# Altium schematic sheet FPGA.SchDoc: =DocumentName
size A3; DocumentNumber: 1; Revision: 0; SheetNumber: 16; SheetTotal: 20; Last modified by: Krzysztof Belewicz
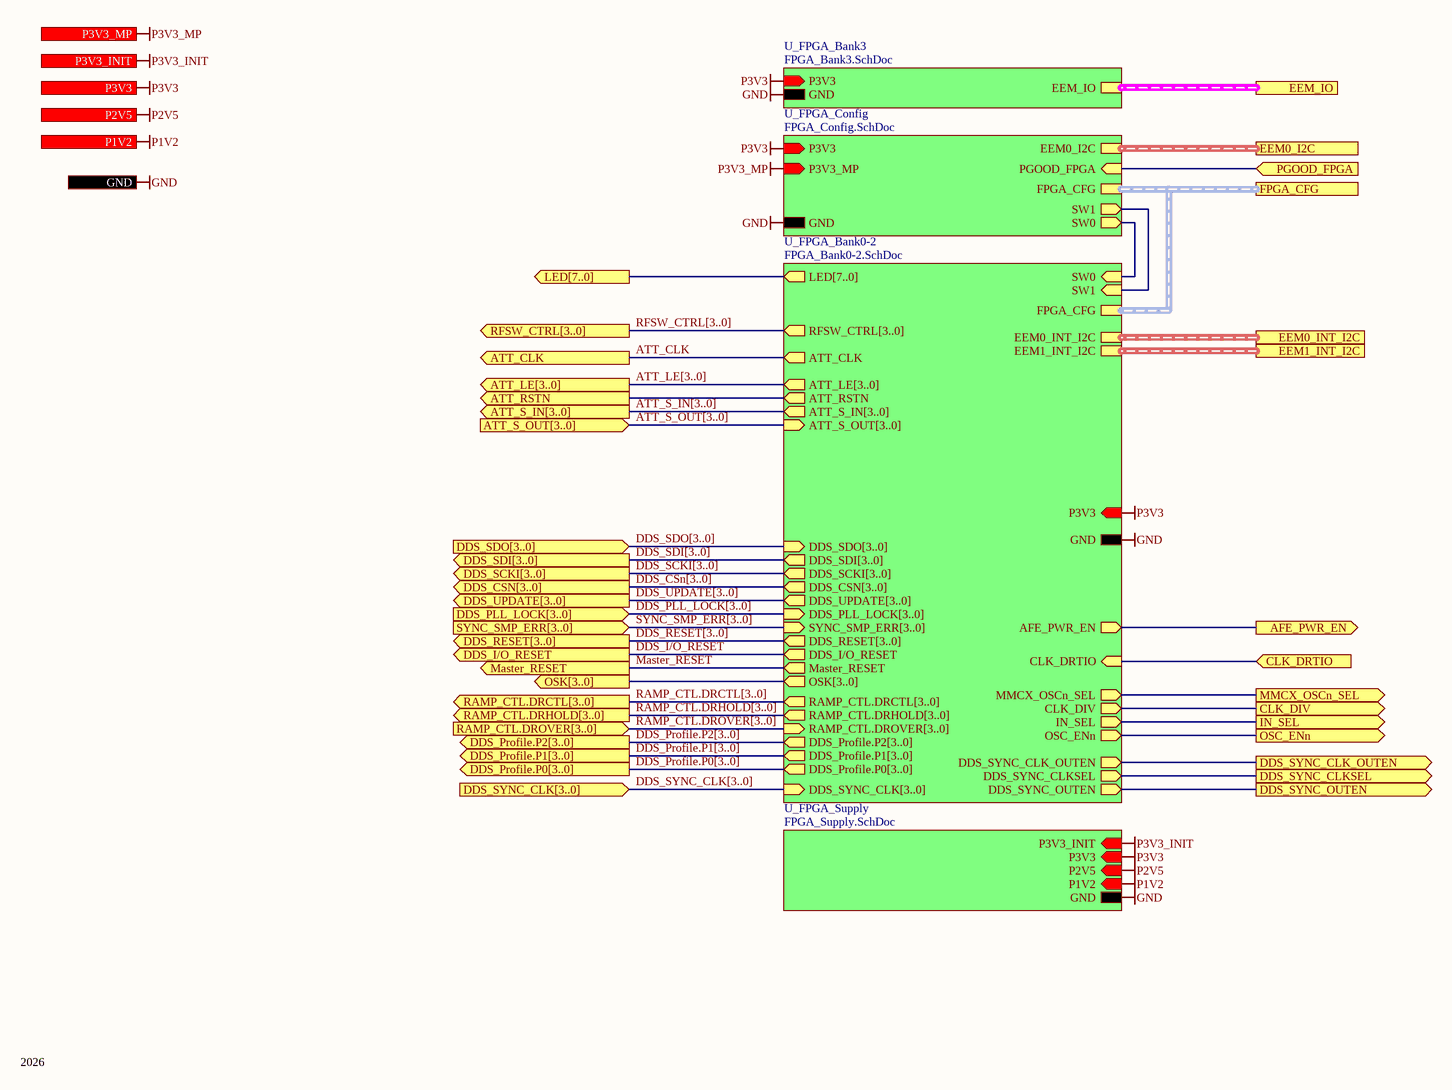
[diagram p0: FPGA.SchDoc]

## Sub-sheets
U_FPGA_Bank0-2 = FPGA_Bank0-2.SchDoc: EEM0_INT_I2C (harness I2C), EEM1_INT_I2C (harness I2C), LED[7..0] (out), FPGA_CFG (harness FPGA_CFG), SW0 (in), RFSW_CTRL[3..0] (out), DDS_SYNC_CLK[3..0] (in), ATT_S_IN[3..0] (out), ATT_S_OUT[3..0] (in), OSK[3..0] (out), ATT_CLK (out), ATT_LE[3..0] (out), ATT_RSTN (out), Master_RESET (out), DDS_UPDATE[3..0] (out), DDS_CSN[3..0] (out), DDS_SCKI[3..0] (out), DDS_SDI[3..0] (out), DDS_SDO[3..0] (in), DDS_I/O_RESET (out), DDS_PLL_LOCK[3..0] (in), SYNC_SMP_ERR[3..0] (in), DDS_RESET[3..0] (out), SW1 (in), GND, P3V3 (in), AFE_PWR_EN (out), DDS_SYNC_CLKSEL (out), DDS_SYNC_OUTEN (out), DDS_SYNC_CLK_OUTEN (out), IN_SEL (out), CLK_DIV (out), MMCX_OSCn_SEL (out), OSC_ENn (out), CLK_DRTIO (in), RAMP_CTL.DRCTL[3..0] (out), RAMP_CTL.DRHOLD[3..0] (out), RAMP_CTL.DROVER[3..0] (in), DDS_Profile.P2[3..0] (out), DDS_Profile.P1[3..0] (out), DDS_Profile.P0[3..0] (out)
U_FPGA_Bank3 = FPGA_Bank3.SchDoc: EEM_IO (harness EEM_LVDS), GND, P3V3 (in)
U_FPGA_Config = FPGA_Config.SchDoc: PGOOD_FPGA (in), FPGA_CFG (harness FPGA_CFG), SW0 (out), SW1 (out), GND, P3V3_MP (in), P3V3 (in), EEM0_I2C (harness I2C)
U_FPGA_Supply = FPGA_Supply.SchDoc: P3V3_INIT (in), P3V3 (in), P2V5 (in), P1V2 (in), GND

## Ports
AFE_PWR_EN (out), ATT_CLK (out), ATT_LE[3..0] (out), ATT_RSTN (out), ATT_S_IN[3..0] (out), ATT_S_OUT[3..0] (in), CLK_DIV (out), CLK_DRTIO (in), DDS_CSN[3..0] (out), DDS_I/O_RESET (out), DDS_PLL_LOCK[3..0] (in), DDS_Profile.P0[3..0] (out), DDS_Profile.P1[3..0] (out), DDS_Profile.P2[3..0] (out), DDS_RESET[3..0] (out), DDS_SCKI[3..0] (out), DDS_SDI[3..0] (out), DDS_SDO[3..0] (in), DDS_SYNC_CLK[3..0] (in), DDS_SYNC_CLK_OUTEN (out), DDS_SYNC_CLKSEL (out), DDS_SYNC_OUTEN (out), DDS_UPDATE[3..0] (out), EEM0_I2C (harness I2C), EEM0_INT_I2C (harness I2C), EEM1_INT_I2C (harness I2C), EEM_IO (harness EEM_LVDS), FPGA_CFG (harness FPGA_CFG), GND, IN_SEL (out), LED[7..0] (out), Master_RESET (out), MMCX_OSCn_SEL (out), OSC_ENn (out), OSK[3..0] (out), P1V2 (in), P2V5 (in), P3V3 (in), P3V3_INIT (in), P3V3_MP (in), PGOOD_FPGA (in), RAMP_CTL.DRCTL[3..0] (out), RAMP_CTL.DRHOLD[3..0] (out), RAMP_CTL.DROVER[3..0] (in), RFSW_CTRL[3..0] (out), SYNC_SMP_ERR[3..0] (in)

## Nets
GND: port GND, sheet U_FPGA_Supply/GND, sheet U_FPGA_Bank0-2/GND, sheet U_FPGA_Config/GND, sheet U_FPGA_Bank3/GND
P1V2: port P1V2, sheet U_FPGA_Supply/P1V2
P2V5: port P2V5, sheet U_FPGA_Supply/P2V5
P3V3: port P3V3, sheet U_FPGA_Supply/P3V3, sheet U_FPGA_Bank0-2/P3V3, sheet U_FPGA_Config/P3V3, sheet U_FPGA_Bank3/P3V3
P3V3_INIT: port P3V3_INIT, sheet U_FPGA_Supply/P3V3_INIT
P3V3_MP: port P3V3_MP, sheet U_FPGA_Config/P3V3_MP
AFE_PWR_EN: port AFE_PWR_EN, sheet U_FPGA_Bank0-2/AFE_PWR_EN
ATT_CLK: port ATT_CLK, sheet U_FPGA_Bank0-2/ATT_CLK
ATT_RSTN: port ATT_RSTN, sheet U_FPGA_Bank0-2/ATT_RSTN
CLK_DIV: port CLK_DIV, sheet U_FPGA_Bank0-2/CLK_DIV
CLK_DRTIO: port CLK_DRTIO, sheet U_FPGA_Bank0-2/CLK_DRTIO
DDS_I/O_RESET: port DDS_I/O_RESET, sheet U_FPGA_Bank0-2/DDS_I/O_RESET
DDS_SYNC_CLK_OUTEN: port DDS_SYNC_CLK_OUTEN, sheet U_FPGA_Bank0-2/DDS_SYNC_CLK_OUTEN
DDS_SYNC_CLKSEL: port DDS_SYNC_CLKSEL, sheet U_FPGA_Bank0-2/DDS_SYNC_CLKSEL
DDS_SYNC_OUTEN: port DDS_SYNC_OUTEN, sheet U_FPGA_Bank0-2/DDS_SYNC_OUTEN
IN_SEL: port IN_SEL, sheet U_FPGA_Bank0-2/IN_SEL
Master_RESET: port Master_RESET, sheet U_FPGA_Bank0-2/Master_RESET
MMCX_OSCn_SEL: port MMCX_OSCn_SEL, sheet U_FPGA_Bank0-2/MMCX_OSCn_SEL
OSC_ENn: port OSC_ENn, sheet U_FPGA_Bank0-2/OSC_ENn
PGOOD_FPGA: port PGOOD_FPGA, sheet U_FPGA_Config/PGOOD_FPGA
(unnamed): sheet U_FPGA_Bank0-2/SW0, sheet U_FPGA_Config/SW0
(unnamed): sheet U_FPGA_Bank0-2/SW1, sheet U_FPGA_Config/SW1

## Buses and harness runs
bus ATT_LE[3..0] = port ATT_LE[3..0] = sheet U_FPGA_Bank0-2/ATT_LE[3..0]
bus ATT_S_IN[3..0] = port ATT_S_IN[3..0] = sheet U_FPGA_Bank0-2/ATT_S_IN[3..0]
bus ATT_S_OUT[3..0] = port ATT_S_OUT[3..0] = sheet U_FPGA_Bank0-2/ATT_S_OUT[3..0]
bus DDS_CSn[3..0] = port DDS_CSN[3..0] = sheet U_FPGA_Bank0-2/DDS_CSN[3..0]
bus DDS_PLL_LOCK[3..0] = port DDS_PLL_LOCK[3..0] = sheet U_FPGA_Bank0-2/DDS_PLL_LOCK[3..0]
bus DDS_Profile.P0[3..0] = port DDS_Profile.P0[3..0] = sheet U_FPGA_Bank0-2/DDS_Profile.P0[3..0]
bus DDS_Profile.P1[3..0] = port DDS_Profile.P1[3..0] = sheet U_FPGA_Bank0-2/DDS_Profile.P1[3..0]
bus DDS_Profile.P2[3..0] = port DDS_Profile.P2[3..0] = sheet U_FPGA_Bank0-2/DDS_Profile.P2[3..0]
bus DDS_RESET[3..0] = port DDS_RESET[3..0] = sheet U_FPGA_Bank0-2/DDS_RESET[3..0]
bus DDS_SCKI[3..0] = port DDS_SCKI[3..0] = sheet U_FPGA_Bank0-2/DDS_SCKI[3..0]
bus DDS_SDI[3..0] = port DDS_SDI[3..0] = sheet U_FPGA_Bank0-2/DDS_SDI[3..0]
bus DDS_SDO[3..0] = port DDS_SDO[3..0] = sheet U_FPGA_Bank0-2/DDS_SDO[3..0]
bus DDS_SYNC_CLK[3..0] = port DDS_SYNC_CLK[3..0] = sheet U_FPGA_Bank0-2/DDS_SYNC_CLK[3..0]
bus DDS_UPDATE[3..0] = port DDS_UPDATE[3..0] = sheet U_FPGA_Bank0-2/DDS_UPDATE[3..0]
bus port LED[7..0] = sheet U_FPGA_Bank0-2/LED[7..0]
bus port OSK[3..0] = sheet U_FPGA_Bank0-2/OSK[3..0]
bus RAMP_CTL.DRCTL[3..0] = port RAMP_CTL.DRCTL[3..0] = sheet U_FPGA_Bank0-2/RAMP_CTL.DRCTL[3..0]
bus RAMP_CTL.DRHOLD[3..0] = port RAMP_CTL.DRHOLD[3..0] = sheet U_FPGA_Bank0-2/RAMP_CTL.DRHOLD[3..0]
bus RAMP_CTL.DROVER[3..0] = port RAMP_CTL.DROVER[3..0] = sheet U_FPGA_Bank0-2/RAMP_CTL.DROVER[3..0]
bus RFSW_CTRL[3..0] = port RFSW_CTRL[3..0] = sheet U_FPGA_Bank0-2/RFSW_CTRL[3..0]
bus SYNC_SMP_ERR[3..0] = port SYNC_SMP_ERR[3..0] = sheet U_FPGA_Bank0-2/SYNC_SMP_ERR[3..0]
harness port EEM0_I2C = sheet U_FPGA_Config/EEM0_I2C
harness port EEM0_INT_I2C = sheet U_FPGA_Bank0-2/EEM0_INT_I2C
harness port EEM1_INT_I2C = sheet U_FPGA_Bank0-2/EEM1_INT_I2C
harness port EEM_IO = sheet U_FPGA_Bank3/EEM_IO
harness port FPGA_CFG = sheet U_FPGA_Bank0-2/FPGA_CFG = sheet U_FPGA_Config/FPGA_CFG

## Notes on the sheet
- 2026
- SINARA
- Project:
- Designed by:
- Filename:
- Size:
- Version:
- Last mod. date :
- Sheet:
- A4
- Copyright _______________
  This source describes Open Hardware and is licensed under the CERN-OHL-W v2. You may redistribute and modify this documentation and make products using it under the terms of the CERN-OHL-W v2 (https:/cern.ch/cern-ohl). This documentation is distributed WITHOUT ANY EXPRESS OR IMPLIED WARRANTY, INCLUDING OF MERCHANTABILITY, SATISFACTORY QUALITY AND FITNESS FOR A PARTICULAR PURPOSE. Please see the CERN-OHL-W v2 for applicable conditions.
  As per CERN-OHL-W v2 section 4.1, should You produce hardware based on these sources, You must maintain the Source Location visible on the external case of the product you make using this documentation.
  Source location: =Github
- Last mod. by :